# Altium schematic sheet Sheet1.SchDoc
size B
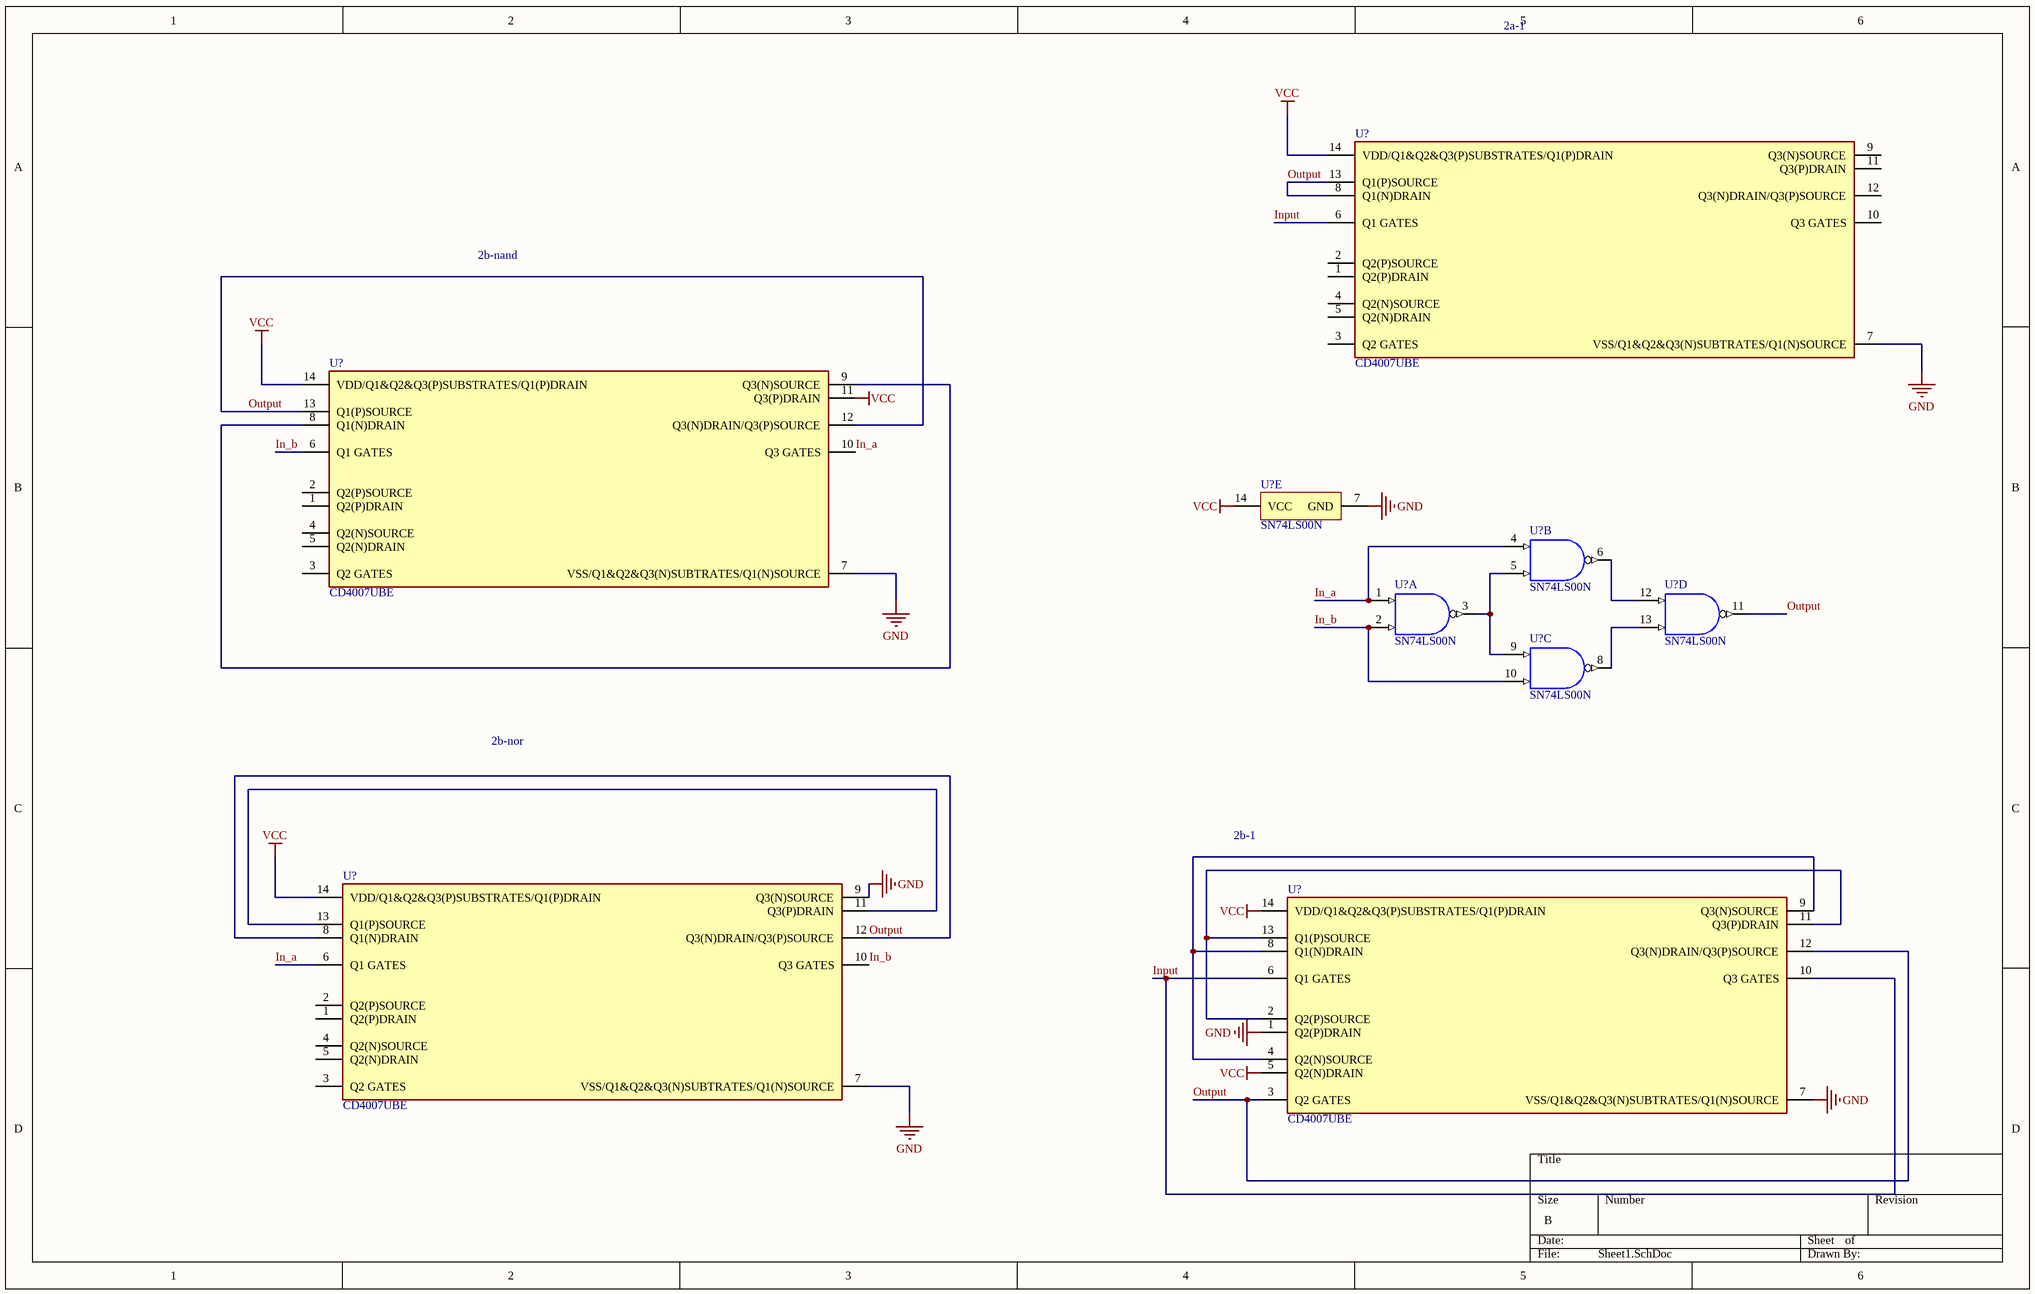
[diagram p0: Sheet1.SchDoc]

## Parts
(Parts that share a designator on the sheet are numbered #1, #2 ... from top to bottom, then left to right.)
U?#1  CD4007UBE  [FP-N0014A-MFG]
U?#2  CD4007UBE  [FP-N0014A-MFG]
U?#3  SN74LS00N  [N0014A]  (part E of 5)
U?#4  SN74LS00N  [N0014A]  (part B of 5)
U?#5  SN74LS00N  [N0014A]  (part A of 5)
U?#6  SN74LS00N  [N0014A]  (part D of 5)
U?#7  SN74LS00N  [N0014A]  (part C of 5)
U?#8  CD4007UBE  [FP-N0014A-MFG]
U?#9  CD4007UBE  [FP-N0014A-MFG]

## Nets
GND: U?#1.7(VSS/Q1&Q2&Q3(N)SUBTRATES/Q1(N)SOURCE) U?#2.7(VSS/Q1&Q2&Q3(N)SUBTRATES/Q1(N)SOURCE) U?#3.7(GND) U?#8.7(VSS/Q1&Q2&Q3(N)SUBTRATES/Q1(N)SOURCE) U?#8.9(Q3(N)SOURCE) U?#9.1(Q2(P)DRAIN) U?#9.7(VSS/Q1&Q2&Q3(N)SUBTRATES/Q1(N)SOURCE)
VCC: U?#1.14(VDD/Q1&Q2&Q3(P)SUBSTRATES/Q1(P)DRAIN) U?#2.11(Q3(P)DRAIN) U?#2.14(VDD/Q1&Q2&Q3(P)SUBSTRATES/Q1(P)DRAIN) U?#3.14(VCC) U?#8.14(VDD/Q1&Q2&Q3(P)SUBSTRATES/Q1(P)DRAIN) U?#9.5(Q2(N)DRAIN) U?#9.14(VDD/Q1&Q2&Q3(P)SUBSTRATES/Q1(P)DRAIN)
In_a: U?#2.10(Q3_GATES) U?#4.4(2A) U?#5.1(1A) U?#8.6(Q1_GATES)
In_b: U?#2.6(Q1_GATES) U?#5.2(1B) U?#7.10(3B) U?#8.10(Q3_GATES)
Input: U?#1.6(Q1_GATES) U?#9.6(Q1_GATES) U?#9.10(Q3_GATES)
Output: U?#1.8(Q1(N)DRAIN) U?#1.13(Q1(P)SOURCE) U?#2.12(Q3(N)DRAIN/Q3(P)SOURCE) U?#2.13(Q1(P)SOURCE) U?#6.11(4Y) U?#8.8(Q1(N)DRAIN) U?#8.12(Q3(N)DRAIN/Q3(P)SOURCE) U?#9.3(Q2_GATES) U?#9.12(Q3(N)DRAIN/Q3(P)SOURCE)
NetU?#2_8: U?#2.8(Q1(N)DRAIN) U?#2.9(Q3(N)SOURCE)
NetU?#4_5: U?#4.5(2B) U?#5.3(1Y) U?#7.9(3A)
NetU?#4_6: U?#4.6(2Y) U?#6.12(4A)
NetU?#6_13: U?#6.13(4B) U?#7.8(3Y)
NetU?#8_11: U?#8.11(Q3(P)DRAIN) U?#8.13(Q1(P)SOURCE)
NetU?#9_2: U?#9.2(Q2(P)SOURCE) U?#9.11(Q3(P)DRAIN) U?#9.13(Q1(P)SOURCE)
NetU?#9_4: U?#9.4(Q2(N)SOURCE) U?#9.8(Q1(N)DRAIN) U?#9.9(Q3(N)SOURCE)

Not connected (* = marked no-connect by the designer): U?#1 1(Q2(P)DRAIN) 2(Q2(P)SOURCE) 3(Q2_GATES) 4(Q2(N)SOURCE) 5(Q2(N)DRAIN) 9(Q3(N)SOURCE) 10(Q3_GATES) 11(Q3(P)DRAIN) 12(Q3(N)DRAIN/Q3(P)SOURCE); U?#2 1(Q2(P)DRAIN) 2(Q2(P)SOURCE) 3(Q2_GATES) 4(Q2(N)SOURCE) 5(Q2(N)DRAIN); U?#8 1(Q2(P)DRAIN) 2(Q2(P)SOURCE) 3(Q2_GATES) 4(Q2(N)SOURCE) 5(Q2(N)DRAIN)

## Notes on the sheet
- 2a-1
- 2b-nand
- 2b-nor
- 2b-1

## Library data of the parts
U?#1 U?#2 U?#8 U?#9 = CMP-1632-00008-3: IC DUAL COMPL PAIR W/INV 14-DIP; Manufacturer: Texas Instruments; Standoff Height: 0.51mm; Number Of Inputs: 3; Logic Function Desc: Inverting, NOR, NAND; Min Supply Voltage: 3V; Description: Complementary Pair Plus Inverter IC 14-PDIP; Quiescent Current: 0.25-150uA; Max Supply Voltage: 18V; Propagation Delay: 25ns; Digikey Description: IC DUAL COMPL PAIR W/INV 14-DIP; Device Class L3: Logic Gates; Device Class L2: Logic ICs; Category: IC; RoHS: TRUE; Device Class L1: Integrated Circuits (ICs); Ambient Temperature Range High: +125°C; Ambient Temperature Range Low: -55°C; Mouser Description: Dual Complementary Pair Plus Inverter 3-CH Inverting CMOS 14-Pin PDIP Tube; Number Of Circuits: 3; ComponentLink2Description: Datasheet; Automotive: No; Manufacturer Part Number: CD4007UBE; Temperature Range High: +125°C; Height: 5.08mm; Temperature Range Low: -55°C; Number Of Outputs: 3; Lead Free: Yes; Octopart: https://octopart.com/cd4007ube-texas+instruments-465129; Temperature: -55°C to +125°C; ComponentLink2URL: http://www.ti.com/general/docs/suppproductinfo.tsp?distId=10&gotoUrl=http%3A%2F%2Fwww.ti.com%2Flit%2Fgpn%2Fcd4007ub; Package: N0014A; Ipc Land Pattern Name: DIP794W46P254L1969H508Q14
U?#3-U?#7 = CMP-1627-00476-2: Quad 2-input positive-NAND gates, N0014A, TUBE; Manufacturer: Texas Instruments; VCC(Min)(V): 4.75; F @ Nom Voltage(Max)(Mhz): 35; Voltage(Nom)(V): 5; Rating: Catalog; tpd @ Nom Voltage(Max)(ns): 22; Output Type: TTL; Schmitt Trigger: No; Output Drive (IOL/IOH)(Max)(mA): 0.4/-16; Technology Family: LS; ICC @ Nom Voltage(Max)(mA): 0.022; VCC(Max)(V): 5.25; Bits(#): 4; Code_JEDEC: MS-001; Generic Part Number: SN74LS00; Input Type: TTL; Operating Temperature Range(C): 0 to 70; PackageReference: N0014A; DatasheetVersion: SDLS025B